# EAGLE design right (EAGLE 9.6.2)
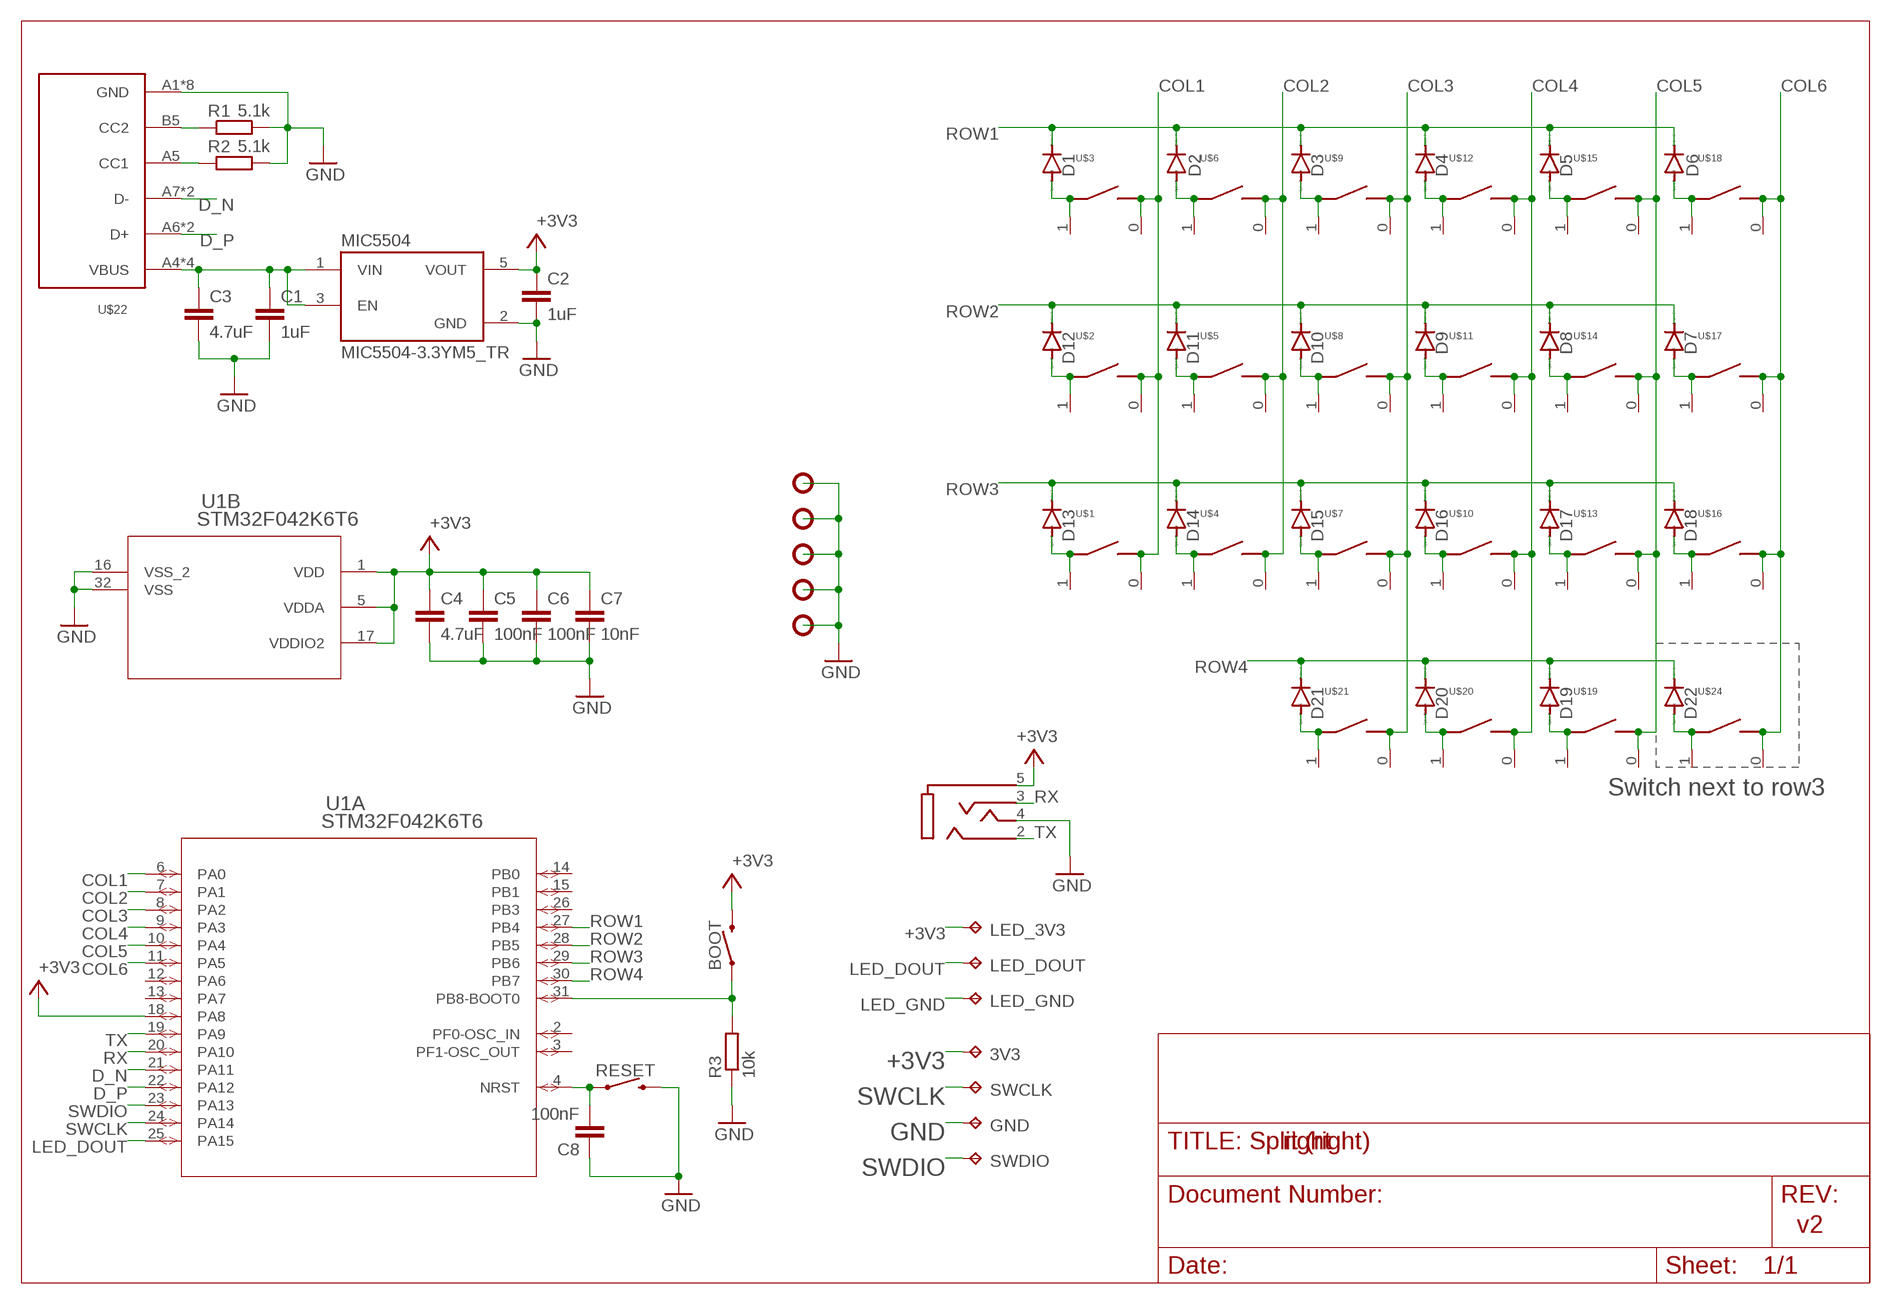
[diagram p0: schematic, sheet 1]

## Parts
3V3  TPTP20R  [TP20R]
BOOT  MOMENTARY-SWITCH-SPST-SMD-6.2MM-TALL  [TACTILE_SWITCH_SMD_6.2MM]
C1  1uF  C-EUC0603  [C0603]
C2  1uF  C-EUC0603  [C0603]
C3  4.7uF  C-EUC0603  [C0603]
C4  4.7uF  C-EUC0603  [C0603]
C5  100nF  C-EUC0603  [C0603]
C6  100nF  C-EUC0603  [C0603]
C7  10nF  C-EUC0603  [C0603]
C8  100nF  C-EUC0603  [C0603]
D1  DIODE-MINIMELF  [MINIMELF]
D2  DIODE-MINIMELF  [MINIMELF]
D3  DIODE-MINIMELF  [MINIMELF]
D4  DIODE-MINIMELF  [MINIMELF]
D5  DIODE-MINIMELF  [MINIMELF]
D6  DIODE-MINIMELF  [MINIMELF]
D7  DIODE-MINIMELF  [MINIMELF]
D8  DIODE-MINIMELF  [MINIMELF]
D9  DIODE-MINIMELF  [MINIMELF]
D10  DIODE-MINIMELF  [MINIMELF]
D11  DIODE-MINIMELF  [MINIMELF]
D12  DIODE-MINIMELF  [MINIMELF]
D13  DIODE-MINIMELF  [MINIMELF]
D14  DIODE-MINIMELF  [MINIMELF]
D15  DIODE-MINIMELF  [MINIMELF]
D16  DIODE-MINIMELF  [MINIMELF]
D17  DIODE-MINIMELF  [MINIMELF]
D18  DIODE-MINIMELF  [MINIMELF]
D19  DIODE-MINIMELF  [MINIMELF]
D20  DIODE-MINIMELF  [MINIMELF]
D21  DIODE-MINIMELF  [MINIMELF]
D22  DIODE-MINIMELF  [MINIMELF]
GND  TPTP20R  [TP20R]
LED_3V3  TPTP20R  [TP20R]
LED_DOUT  TPTP20R  [TP20R]
LED_GND  TPTP20R  [TP20R]
MIC5504  MIC5504-3.3YM5_TR  [SOT95P280X145-5N]
R1  5.1k  R-EU_R0603  [R0603]
R2  5.1k  R-EU_R0603  [R0603]
R3  10k  R-EU_R0603  [R0603]
RESET  MOMENTARY-SWITCH-SPST-SMD-6.2MM-TALL  [TACTILE_SWITCH_SMD_6.2MM]
SWCLK  TPTP20R  [TP20R]
SWDIO  TPTP20R  [TP20R]
U1  STM32F042K6T6  [LQFP-32]
U$1  CHOC-CHOC-1U  [CHOC-1U]
U$2  CHOC-CHOC-1U  [CHOC-1U]
U$3  CHOC-CHOC-1U  [CHOC-1U]
U$4  CHOC-CHOC-1U  [CHOC-1U]
U$5  CHOC-CHOC-1U  [CHOC-1U]
U$6  CHOC-CHOC-1U  [CHOC-1U]
U$7  CHOC-CHOC-1U  [CHOC-1U]
U$8  CHOC-CHOC-1U  [CHOC-1U]
U$9  CHOC-CHOC-1U  [CHOC-1U]
U$10  CHOC-CHOC-1U  [CHOC-1U]
U$11  CHOC-CHOC-1U  [CHOC-1U]
U$12  CHOC-CHOC-1U  [CHOC-1U]
U$13  CHOC-CHOC-1U  [CHOC-1U]
U$14  CHOC-CHOC-1U  [CHOC-1U]
U$15  CHOC-CHOC-1U  [CHOC-1U]
U$16  CHOC-CHOC-1U  [CHOC-1U]
U$17  CHOC-CHOC-1U  [CHOC-1U]
U$18  CHOC-CHOC-1U  [CHOC-1U]
U$19  CHOC-CHOC-1U  [CHOC-1U]
U$20  CHOC-CHOC-1U  [CHOC-1U]
U$21  CHOC-CHOC-1U  [CHOC-1U]
U$22  217B-AG01  [217B-AG01]
U$23  PJ320A  [PJ320A]
U$24  CHOC-CHOC-1U  [CHOC-1U]
U$25  SOCKET  [CHOC-SOCKET]
U$26  SOCKET  [CHOC-SOCKET]
U$27  SOCKET  [CHOC-SOCKET]
U$28  SOCKET  [CHOC-SOCKET]
U$29  SOCKET  [CHOC-SOCKET]
U$30  SOCKET  [CHOC-SOCKET]
U$31  SOCKET  [CHOC-SOCKET]
U$32  SOCKET  [CHOC-SOCKET]
U$33  SOCKET  [CHOC-SOCKET]
U$34  SOCKET  [CHOC-SOCKET]
U$35  SOCKET  [CHOC-SOCKET]
U$36  SOCKET  [CHOC-SOCKET]
U$37  SOCKET  [CHOC-SOCKET]
U$38  SOCKET  [CHOC-SOCKET]
U$39  SOCKET  [CHOC-SOCKET]
U$40  SOCKET  [CHOC-SOCKET]
U$41  SOCKET  [CHOC-SOCKET]
U$42  SOCKET  [CHOC-SOCKET]
U$43  SOCKET  [CHOC-SOCKET]
U$44  SOCKET  [CHOC-SOCKET]
U$45  SOCKET  [CHOC-SOCKET]
U$46  SOCKET  [CHOC-SOCKET]
U$47  MOUNTING-PADHOLE-M2-OFFSET  [HOLE-M2-OFFSET]
U$48  MOUNTING-PADHOLE-M2-OFFSET  [HOLE-M2-OFFSET]
U$49  MOUNTING-PADHOLE-M2-OFFSET  [HOLE-M2-OFFSET]
U$50  MOUNTING-PADHOLE-M2-OFFSET  [HOLE-M2-OFFSET]
U$51  MOUNTING-PADHOLE-M2-OFFSET  [HOLE-M2-OFFSET]

## Nets
+3V3: 3V3.TP BOOT.B2 C2.1 C4.1 C5.1 C6.1 C7.1 LED_3V3.TP MIC5504.5(VOUT) U1.1(B:VDD) U1.5(B:VDDA) U1.17(B:VDDIO2) U1.18(A:PA8) U$23.5
COL1: U1.6(A:PA0) U$1.1 U$2.1 U$3.1 U$25.0 U$26.0 U$30.0
COL2: U1.7(A:PA1) U$4.1 U$5.1 U$6.1 U$27.0 U$31.0 U$46.0
COL3: U1.8(A:PA2) U$7.1 U$8.1 U$9.1 U$21.1 U$28.0 U$29.0 U$32.0 U$34.0
COL4: U1.9(A:PA3) U$10.1 U$11.1 U$12.1 U$20.1 U$33.0 U$35.0 U$41.0 U$45.0
COL5: U1.10(A:PA4) U$13.1 U$14.1 U$15.1 U$19.1 U$36.0 U$39.0 U$40.0 U$44.0
COL6: U1.11(A:PA5) U$16.1 U$17.1 U$18.1 U$24.1 U$37.0 U$38.0 U$42.0 U$43.0
D_N: U1.21(A:PA11) U$22.A7(D-) U$22.B7(D-)
D_P: U1.22(A:PA12) U$22.A6(D+) U$22.B6(D+)
GND: C1.2 C2.2 C3.2 C4.2 C5.2 C6.2 C7.2 C8.1 GND.TP MIC5504.2(GND) R1.2 R2.2 R3.1 RESET.B2 U1.16(B:VSS_2) U1.32(B:VSS) U$22.A1(GND) U$22.A12(GND) U$22.B1(GND) U$22.B12(GND) U$22.SHELL1(GND) U$22.SHELL2(GND) U$22.SHELL3(GND) U$22.SHELL(GND) U$23.4 U$47.P$1(P) U$48.P$1(P) U$49.P$1(P) U$50.P$1(P) U$51.P$1(P)
LED_DOUT: LED_DOUT.TP U1.25(A:PA15)
LED_GND: LED_GND.TP
N$1: R2.1 U$22.A5(CC1)
N$2: R1.1 U$22.B5(CC2)
N$3: C1.1 C3.1 MIC5504.1(VIN) MIC5504.3(EN) U$22.A4(VBUS) U$22.A9(VBUS) U$22.B4(VBUS) U$22.B9(VBUS)
N$4: D1.A U$3.0 U$26.1
N$5: D2.A U$6.0 U$27.1
N$7: D12.A U$2.0 U$25.1
N$8: D11.A U$5.0 U$46.1
N$9: BOOT.A2 R3.2 U1.31(A:PB8-BOOT0)
N$10: C8.2 RESET.A2 U1.4(A:NRST)
N$11: D18.A U$16.0 U$38.1
N$12: D10.A U$8.0 U$29.1
N$13: D9.A U$11.0 U$41.1
N$14: D8.A U$14.0 U$40.1
N$15: D7.A U$17.0 U$42.1
N$16: D22.A U$24.0 U$37.1
N$17: D17.A U$13.0 U$39.1
N$18: D13.A U$1.0 U$30.1
N$19: D14.A U$4.0 U$31.1
N$20: D15.A U$7.0 U$32.1
N$21: D16.A U$10.0 U$33.1
N$22: D20.A U$20.0 U$35.1
N$23: D3.A U$9.0 U$28.1
N$24: D4.A U$12.0 U$45.1
N$25: D5.A U$15.0 U$44.1
N$26: D6.A U$18.0 U$43.1
N$27: D21.A U$21.0 U$34.1
N$28: D19.A U$19.0 U$36.1
ROW1: D1.C D2.C D3.C D4.C D5.C D6.C U1.27(A:PB4)
ROW2: D7.C D8.C D9.C D10.C D11.C D12.C U1.28(A:PB5)
ROW3: D13.C D14.C D15.C D16.C D17.C D18.C U1.29(A:PB6)
ROW4: D19.C D20.C D21.C D22.C U1.30(A:PB7)
RX: U1.20(A:PA10) U$23.3
SWCLK: SWCLK.TP U1.24(A:PA14)
SWDIO: SWDIO.TP U1.23(A:PA13)
TX: U1.19(A:PA9) U$23.2
Unconnected: U1.2(A:PF0-OSC_IN) U1.3(A:PF1-OSC_OUT) U1.12(A:PA6) U1.13(A:PA7) U1.14(A:PB0) U1.15(A:PB1) U1.26(A:PB3)

## Notes on the sheet
- Switch next to row3
- Split (right)
- v2

## Library data of the parts
3V3 GND LED_3V3 LED_DOUT LED_GND SWCLK SWDIO = testpad:TP: Test pad
BOOT RESET = PTS645SH50SMTR92LFS:MOMENTARY-SWITCH-SPST: PTS645SH50SMTR92LFS C&K SPST Pushbutton; PROD_ID: SWCH-11966; SF_SKU: COM-12992
C1-C8 = rcl:C-EU: CAPACITOR, European symbol; SPICEPREFIX: C
D1-D22 = diode:DIODE-: DIODE
MIC5504 = MIC5504-3.3YM5_TR:MIC5504-3.3YM5_TR: Linear Voltage Regulator IC 1 Output 300mA SOT-23-5; AVAILABILITY: Unavailable; DESCRIPTION: Linear Voltage Regulator IC 1 Output 300mA SOT-23-5; MF: Microchip; MP: MIC5504-3.3YM5 TR; PACKAGE: SOT-23 Microchip; PRICE: None
R1-R3 = rcl:R-EU_: RESISTOR, European symbol; SPICEPREFIX: R
U1 = STM32F042K6T6:STM32F042K6T6; BUILT_BY: EMA_UL_Team; COPYRIGHT: Copyright (C) 2018 Accelerated Designs. All rights reserved; MANUFACTURER_PART_NUMBER: STM32F042K6T6; SOURCELIBRARY: Updates_to_database_2020-10-19; VENDOR: STMicroelectronics
U$1-U$21 U$24 = choc:CHOC
U$22 = usbc:217B-AG01
U$23 = PJ320A:PJ320A
U$25-U$46 = choc:SOCKET
U$47-U$51 = platedhole:MOUNTING-PAD

## Board
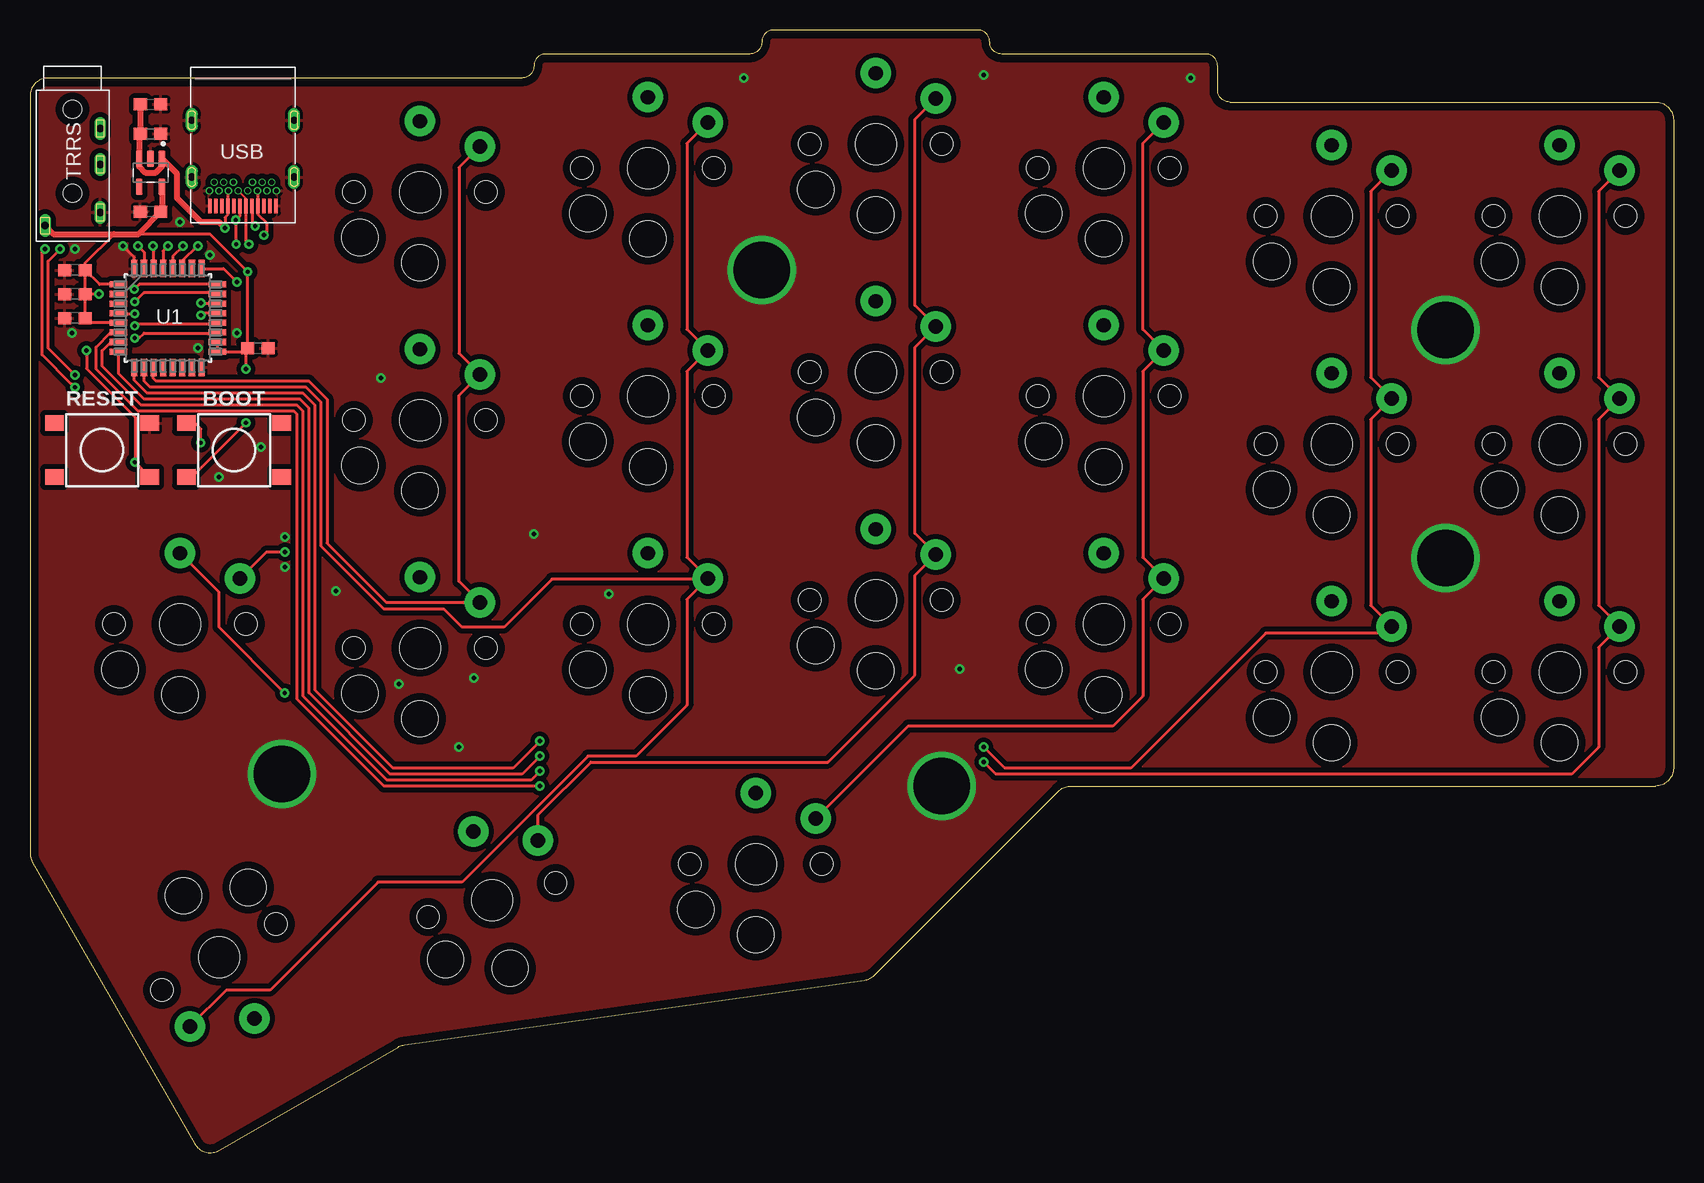
[diagram p1: board, top side]
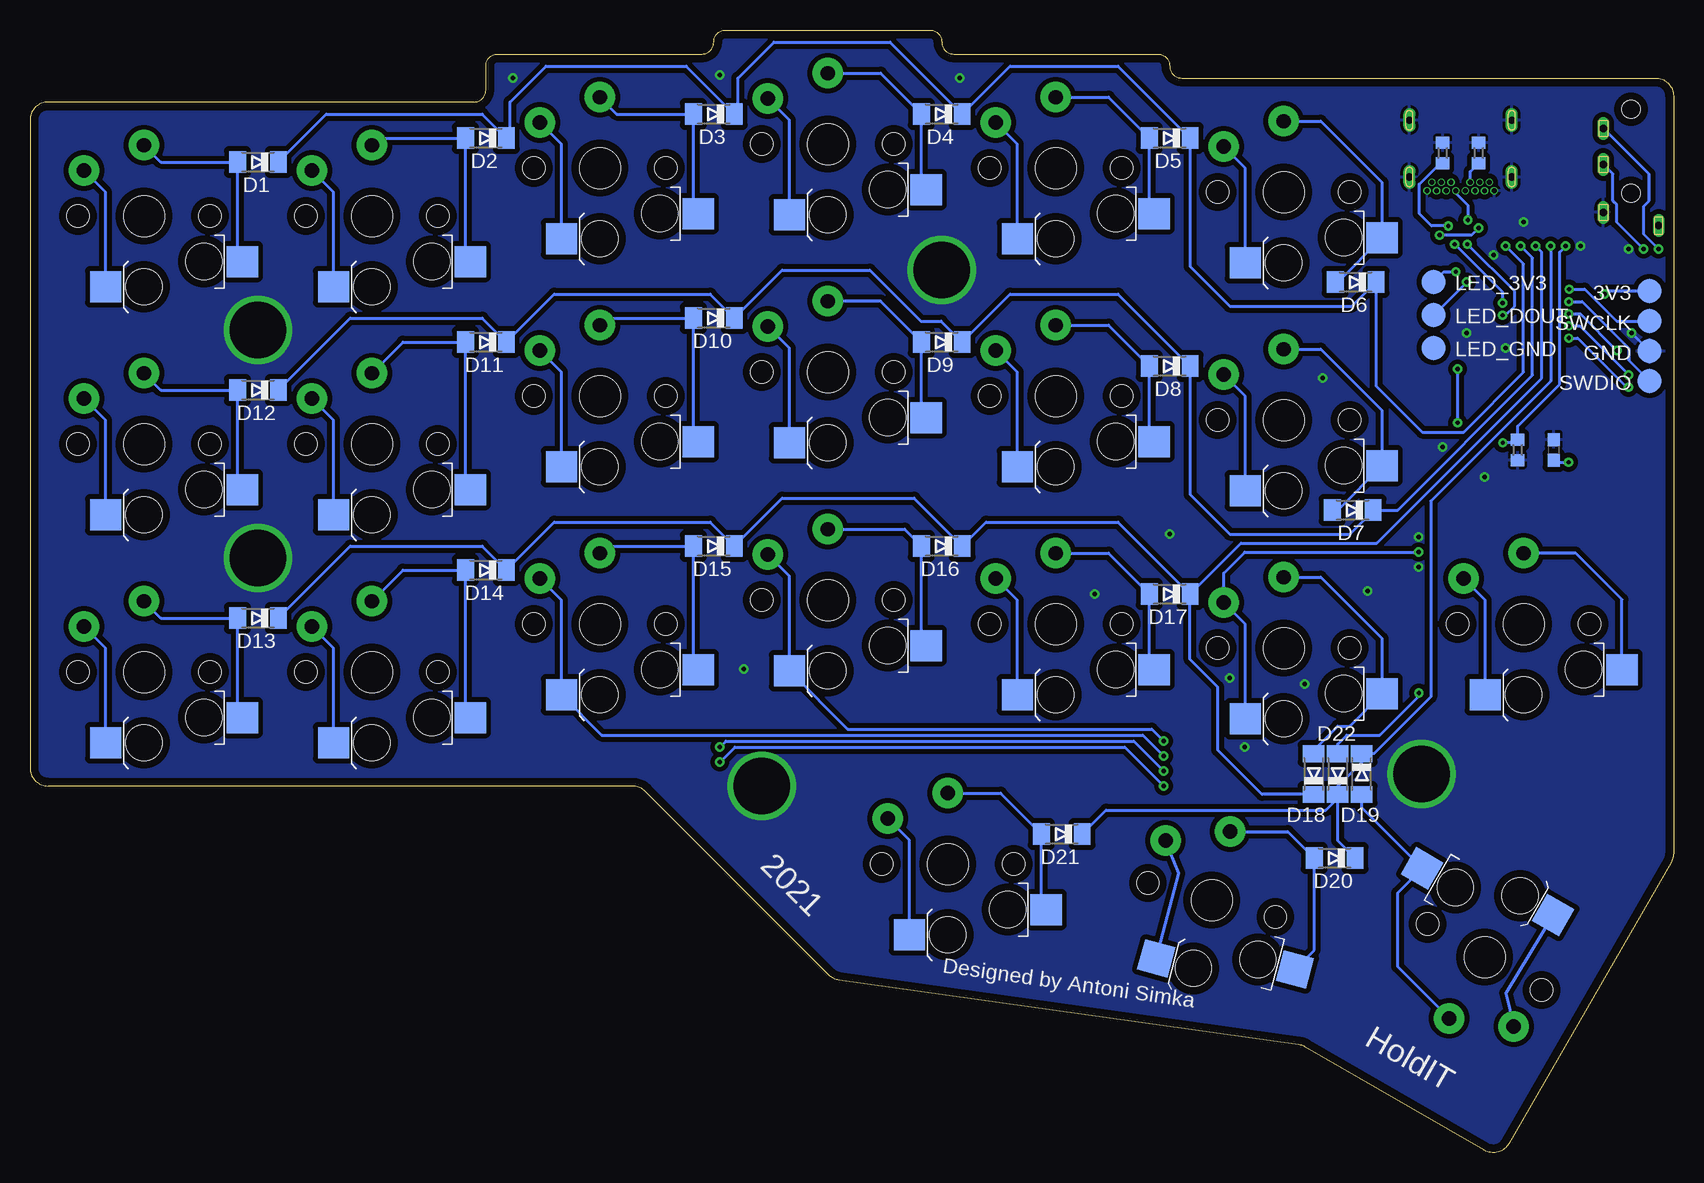
[diagram p2: board, bottom side, seen from below]

Size 137 x 93.56 mm. Coordinates in mm from the lower left corner, seen from the top.
Outline: 100,87.56 135.5,87.56 arc-90 137,86.06 137,32.06 arc-90 135.5,30.56 86.78,30.56 arc45 85.72,30.12 70.41,14.8 arc-37 69.55,14.38 31.22,8.99 arc22 30.68,8.8 15.78,0.2 arc-90 13.73,0.75 0.2,24.21 arc-30 0,24.96 0,88.06 arc-90 1.5,89.56 41,89.56 arc90 42,90.56 arc-90 43,91.56 60,91.56 arc90 61,92.56 arc-90 62,93.56 79,93.56 arc-90 80,92.56 arc90 81,91.56 98,91.56 arc-90 99,90.56 99,88.56 arc90 100,87.56
Copper layers (1*16): Top 0.035mm / dielectric 1.5mm / Bottom 0.035mm
Design rules "default *": minimum track width 6mil, minimum drill 10mil, track to track 8mil, track to pad 8mil, pad to pad 7mil, via to via 10mil, smd to smd 7mil, copper to edge 25mil, drill to drill 6mil, minimum pad ring 4mil, minimum via ring 8mil, stop-mask expansion 4mil, vias tented up to drill 0mil, thermal gap 10mil

### Footprints (pad centres in the part's own frame; a part is rotated, then mirrored left to right if it is on the bottom)
TP20R = smd 2 x 2: TP 0,0
TACTILE_SWITCH_SMD_6.2MM = smd 1.55 x 1.3: A1 -3.975,-2.25; A2 3.975,-2.25; B1 -3.975,2.25; B2 3.975,2.25
C0603 = smd 1.1 x 1: 1 -0.85,0; 2 0.85,0
MINIMELF = smd 1.4 x 1.8: A 1.7,0; C -1.7,0
SOT95P280X145-5N = smd 1.39 x 0.58: 1 -1.165,0.95; 2 -1.165,0; 3 -1.165,-0.95; 4 1.165,-0.95; 5 1.165,0.95
R0603 = smd 1 x 1.1: 1 -0.85,0; 2 0.85,0
LQFP-32 = smd 1.473 x 0.508: 1 -4.115,2.8; 2 -4.115,2; 3 -4.115,1.2; 4 -4.115,0.4; 5 -4.115,-0.4; 6 -4.115,-1.2; 7 -4.115,-2; 8 -4.115,-2.8; 17 4.115,-2.8; 18 4.115,-2; 19 4.115,-1.2; 20 4.115,-0.4; 21 4.115,0.4; 22 4.115,1.2; 23 4.115,2; 24 4.115,2.8 | smd 0.508 x 1.473: 9 -2.8,-4.115; 10 -2,-4.115; 11 -1.2,-4.115; 12 -0.4,-4.115; 13 0.4,-4.115; 14 1.2,-4.115; 15 2,-4.115; 16 2.8,-4.115; 25 2.8,4.115; 26 2,4.115; 27 1.2,4.115; 28 0.4,4.115; 29 -0.4,4.115; 30 -1.2,4.115; 31 -2,4.115; 32 -2.8,4.115
CHOC-1U = drill 1.2 pad 2.54: 0 0,5.9; 1 5,3.8 | hole 3.4: 0,0 | hole 1.85: -5.5,0; 5.5,0
217B-AG01 = smd 0.3 x 1.2: A1 2.75,0.6; A2 2.25,0.6; A3 1.75,0.6; A4 1.25,0.6; A5 0.75,0.6; A6 0.25,0.6; A7 -0.25,0.6; A8 -0.75,0.6; A9 -1.25,0.6; A10 -1.75,0.6; A11 -2.25,0.6; A12 -2.75,0.6 | drill 0.4 pad 0.55: B1 -2.8,1.855; B2 -2.4,2.555; B3 -1.6,2.555; B4 -1.2,1.855; B5 -0.8,2.555; B6 -0.4,1.855; B7 0.4,1.855; B8 0.8,2.555; B9 1.2,1.855; B10 1.6,2.555; B11 2.4,2.555; B12 2.8,1.855; MID -2,1.855; MID1 2,1.855 | drill 0.6 pad 1 long: SHELL -4.27,3; SHELL1 -4.27,7.73; SHELL2 4.27,7.73; SHELL3 4.27,3
PJ320A = drill 0.65 long: 2 -0.75,-3.2; 3 -0.75,-6.2; 4 -0.75,-10.2; 5 -5.35,-11.3 | hole 1.5: -3.05,-1.6; -3.05,-8.6
CHOC-SOCKET = smd 2.6 x 2.6: 0 -3.2,-5.9; 1 8.2,-3.8 | hole 3: 0,-5.9; 5,-3.8
HOLE-M2-OFFSET = drill 4.7: P$1 0,0

### Placement (x,y rotation side)
3V3  2,71.81 0 bottom
BOOT  17,58.56 180 top
C1  10.05,84.91 0 top
C2  10.05,78.41 180 top
C3  10.05,87.36 0 top
C4  3.75,71.56 180 top
C5  3.75,73.56 180 top
C6  19,67.06 0 top
C7  3.75,69.56 180 top
C8  10,58.56 270 bottom
D1  118,82.56 180 bottom
D2  99,84.56 180 bottom
D3  80,86.56 180 bottom
D4  61,86.56 180 bottom
D5  42,84.56 180 bottom
D6  26.5,72.56 180 bottom
D7  26.75,53.56 180 bottom
D8  42,65.56 180 bottom
D9  61,67.56 180 bottom
D10  80,69.56 180 bottom
D11  99,67.56 180 bottom
D12  118,63.56 180 bottom
D13  118,44.56 180 bottom
D14  99,48.56 180 bottom
D15  80,50.56 180 bottom
D16  61,50.56 180 bottom
D17  42,46.56 180 bottom
D18  30,31.56 90 bottom
D19  26,31.56 270 bottom
D20  28.25,24.56 180 bottom
D21  51,26.56 180 bottom
D22  28,31.56 90 bottom
GND  2,66.81 0 bottom
LED_3V3  20,72.56 0 bottom
LED_DOUT  20,69.81 0 bottom
LED_GND  20,67.06 0 bottom
MIC5504  10.05,81.66 270 top
R1  16.25,83.31 90 bottom
R2  19.25,83.31 90 bottom
R3  13,58.56 90 bottom
RESET  6,58.56 0 top
SWCLK  2,69.31 0 bottom
SWDIO  2,64.31 0 bottom
U1  11.5,69.56 0 top
U$1  127.5,40.06 0 top
U$2  127.5,59.06 0 top
U$3  127.5,78.06 0 top
U$4  108.5,40.06 0 top
U$5  108.5,59.06 0 top
U$6  108.5,78.06 0 top
U$7  89.5,44.06 0 top
U$8  89.5,63.06 0 top
U$9  89.5,82.06 0 top
U$10  70.5,46.06 0 top
U$11  70.5,65.06 0 top
U$12  70.5,84.06 0 top
U$13  51.5,44.06 0 top
U$14  51.5,63.06 0 top
U$15  51.5,82.06 0 top
U$16  32.5,42.06 0 top
U$17  32.5,61.06 0 top
U$18  32.5,80.06 0 top
U$19  15.75,16.31 210 top
U$20  38.5,21.06 15 top
U$21  60.5,24.06 0 top
U$22  17.75,78.31 0 top
U$23  6.6,88.56 0 top
U$24  12.5,44.06 0 top
U$25  127.5,59.06 0 bottom
U$26  127.5,78.06 0 bottom
U$27  108.5,78.06 0 bottom
U$28  89.5,82.06 0 bottom
U$29  89.5,63.06 0 bottom
U$30  127.5,40.06 0 bottom
U$31  108.5,40.06 0 bottom
U$32  89.5,44.06 0 bottom
U$33  70.5,46.06 0 bottom
U$34  60.5,24.06 0 bottom
U$35  38.5,21.06 345 bottom
U$36  15.75,16.31 150 bottom
U$37  12.5,44.06 0 bottom
U$38  32.5,42.06 0 bottom
U$39  51.5,44.06 0 bottom
U$40  51.5,63.06 0 bottom
U$41  70.5,65.06 0 bottom
U$42  32.5,61.06 0 bottom
U$43  32.5,80.06 0 bottom
U$44  51.5,82.06 0 bottom
U$45  70.5,84.06 0 bottom
U$46  108.5,59.06 0 bottom
U$47  21,31.56 0 top
U$48  76,30.56 0 top
U$49  118,49.56 0 top
U$50  118,68.56 0 top
U$51  61,73.56 0 top

### Tracks (layer width: path | path; a pad name or v marks a point on that pad's centre or on a via)
+3V3  (via drill 0.35)
  Top 0.254: U1.18 U1.17 17.85,66.76 C6.1 | v5.75,71.56 C4.1 | U1.1 5.8,72.36 C5.1 | U1.5 5,69.16 C7.1 C4.1 | C4.1 C5.1 | C5.1 4.6,74.16 7,76.56 | C6.1 v18.15,73.41 15,76.56 9.05,76.56 | BOOT.B2 13.49,56.31 v18,60.82 | v18,65.31 18,66.91 C6.1
  Top 0.508: MIC5504.5 11,78.51 C2.1 9.05,76.56 7,76.56 1.95,76.56 U$23.5
  Bottom 0.254: 3V3.TP 5.5,71.81 v5.75,71.56 | v18,60.82 v18,65.31 | LED_3V3.TP 19.15,73.41 v18.15,73.41
COL1  (via drill 0.35)
  Top 0.254: U$3.1 130.75,80.11 130.75,64.61 U$2.1 130.75,61.11 130.75,45.61 U$1.1 130.75,42.11 130.75,33.81 128.5,31.56 80.5,31.56 v79.5,32.56 | U1.6 6.73,68.36 5.5,67.13 5.5,65.31 9,61.81 22,61.81 22.25,61.56 22.25,37.81 29.5,30.56 v42.5,30.56
  Bottom 0.254: U$30.0 130.7,42.06 U$1.1 | U$25.0 130.7,61.06 U$2.1 | U$26.0 130.7,80.06 U$3.1 | v42.5,30.56 45.75,33.81 78.25,33.81 v79.5,32.56
COL2  (via drill 0.35)
  Top 0.254: U$6.1 111.75,80.11 111.75,64.61 U$5.1 111.75,61.11 111.75,45.61 U$4.1 112.95,43.31 103,43.31 91.75,32.06 81.25,32.06 v79.5,33.81 | U1.7 6.73,67.56 6,66.83 6,65.56 9.25,62.31 22.25,62.31 22.75,61.81 22.75,38.06 29.75,31.06 41.75,31.06 v42.5,31.81
  Bottom 0.254: U$31.0 111.7,42.06 U$4.1 | U$46.0 111.7,61.06 U$5.1 | U$27.0 111.7,80.06 U$6.1 | v42.5,31.81 45,34.31 79,34.31 v79.5,33.81
COL3  (via drill 0.35)
  Top 0.254: U$9.1 92.75,84.11 92.75,68.61 U$8.1 92.75,65.11 92.75,49.61 U$7.1 92.75,46.11 92.75,38.06 90.25,35.56 73.2,35.56 U$21.1 | U1.8 7.38,64.92 9.5,62.81 22.5,62.81 23.25,62.06 23.25,38.31 30,31.56 41,31.56 v42.5,33.06
  Bottom 0.254: U$7.1 92.7,46.06 U$32.0 89.35,34.81 44.25,34.81 v42.5,33.06 | U$29.0 92.7,65.06 U$8.1 | U$28.0 92.7,84.06 U$9.1 | U$34.0 63.7,26.06 U$21.1
COL4  (via drill 0.35)
  Top 0.254: U$12.1 73.75,86.11 73.75,70.61 U$11.1 73.75,67.11 73.75,51.61 U$10.1 73.75,48.11 73.75,39.81 66.5,32.56 46.75,32.56 42.35,28.15 U$20.1 | U1.9 8.7,64.36 9.75,63.31 22.75,63.31 23.75,62.31 23.75,38.56 30.25,32.06 40.25,32.06 v42.5,34.31
  Bottom 0.254: U$45.0 73.7,86.06 U$12.1 | U$41.0 73.7,67.06 U$11.1 | U$10.1 73.7,48.06 U$33.0 68.85,35.31 43.5,35.31 v42.5,34.31 | U$35.0 41.25,23.31 U$20.1
COL5
  Top 0.254: U$15.1 54.75,84.11 54.75,68.61 U$14.1 54.75,65.11 54.75,49.61 U$13.1 | U1.10 9.5,64.31 10,63.81 23,63.81 24.25,62.56 24.25,50.56 29.5,45.31 34.5,45.31 36,43.81 39.5,43.81 43.5,47.81 56.45,47.81 U$13.1 | U$13.1 54.75,46.11 54.75,37.31 50.5,33.06 46.5,33.06 36,22.56 29,22.56 20,13.56 16.36,13.56 U$19.1
  Bottom 0.254: U$40.0 54.7,65.06 U$14.1 | U$39.0 54.7,46.06 U$13.1 | U$44.0 54.7,84.06 U$15.1 | U$36.0 14,13.31 U$19.1
COL6  (via drill 0.35)
  Top 0.254: U$18.1 35.75,82.11 35.75,66.61 U$17.1 35.75,63.11 35.75,47.61 U$16.1 29.7,45.86 24.75,50.81 24.75,62.81 23.25,64.31 10.5,64.31 10.25,64.56 10.25,65.39 U1.11 | v21.25,50.06 19.7,50.06 U$24.1
  Bottom 0.254: U$38.0 35.7,44.06 U$16.1 37.5,48.31 35.75,50.06 v21.25,50.06 | U$42.0 35.7,63.06 U$17.1 | U$43.0 35.7,82.06 U$18.1 | U$37.0 15.7,46.06 U$24.1
D_N  (via drill 0.35)
  Top 0.254: U$22.A7 17.5,78.08 v17.15,77.73 17.18,77.7 v17.18,75.71 | U1.21 14.41,69.96 v14.25,69.8
  Bottom 0.254: U$22.B7 18.15,79.96 17.15,78.96 v17.15,77.73 | v14.25,69.8 14.01,69.8 13.25,70.56 13.25,71.78 v17.18,75.71
D_P  (via drill 0.35)
  Top 0.152: U$22.B6 18,79.51 U$22.A6
  Top 0.254: U1.22 14.3,70.76 v14.25,70.81 | v18.25,75.71 18,75.96 U$22.A6
  Bottom 0.254: v14.25,70.81 14.25,71.71 v18.25,75.71
GND  (via drill 0.35)
  Top 0.254: U1.32 8.7,74.61 v7.75,75.56
  Bottom 0.254: GND.TP v3.5,68.31
  other vias: 3.75,75.31 14,67.06 17.25,68.31 12.5,77.56 19.25,58.81 21.25,51.31 21.25,48.81 25.5,46.81 42,51.56 48.25,46.56 30.75,39.06 37,39.56 77.5,40.31 59.5,89.56 79.5,89.81 96.75,89.56 15.75,56.31 29.25,64.56 35.75,33.81 15,74.81
  pour Bottom (isolate 0.406): -2,94.56 -2,-0.44 arc90 0,-2.44 138,-2.44 arc90 139,-1.44 139,94.56 arc90 138,95.56 -1,95.56 arc90
  pour Top (isolate 0.406): -3,95.56 -3,-2.44 arc90 -2,-3.44 139,-3.44 arc90 140,-2.44 140,95.56 arc90 139,96.56 -2,96.56 arc90
LED_DOUT  (via drill 0.35)
  Top 0.254: U1.25 16.14,73.67 v17.25,72.56
  Bottom 0.254: LED_DOUT.TP v17.25,72.56
N$1  (via drill 0.35)
  Top 0.254: U$22.A5 18.5,77.48 v18.76,77.23
  Bottom 0.254: v18.76,77.23 20.17,77.23 21.19,78.25 21.19,80.72 19.45,82.46 R2.1
N$2
  Bottom 0.254: U$22.B5 16.95,81.76 R1.1
N$3  (via drill 0.35)
  Top 0.254: U$22.B4 16.5,80.11 U$22.A9 16.48,78.89 16.48,78.17 16.25,77.94 v16.25,77.06 | U$22.B9 19,80.11 U$22.A4 19.02,78.89 19.02,78.17 19.75,77.44 19.75,76.72 v19.5,76.47
  Top 0.508: C3.1 C1.1 9.1,84.81 MIC5504.3 9.1,82.18 9.61,81.67 10.49,81.67 11,82.18 MIC5504.1 12.25,81.57 12.25,79.56 14.25,77.56 15.75,77.56 v16.25,77.06
  Bottom 0.254: v16.25,77.06 16.84,76.47 v19.5,76.47
N$4
  Bottom 0.254: U$26.1 119.7,74.66 D1.A 126.1,82.56 U$3.0
N$5
  Bottom 0.254: U$27.1 100.7,74.66 D2.A 107.9,84.56 U$6.0
N$7
  Bottom 0.254: U$25.1 119.7,55.66 D12.A 126.1,63.56 U$2.0
N$8
  Bottom 0.254: U$5.0 105.9,67.56 D11.A 100.7,55.66 U$46.1
N$9  (via drill 0.35)
  Top 0.254: v9,75.56 9.5,75.06 U1.31 | v14.24,59.16 14.24,60.32 13.75,60.81 BOOT.A2
  Bottom 0.254: v9,75.56 9.5,75.06 9.5,64.06 13,60.56 R3.2 13.25,59.16 v14.24,59.16
N$10  (via drill 0.35)
  Top 0.254: U1.4 7.44,69.91 v8.74,69.91 | RESET.A2 v8.75,57.53 8.75,61.31 4.71,65.35 v4.71,66.85
  Bottom 0.254: v8.74,69.91 7.77,69.91 v4.71,66.85 | C8.2 9.83,57.53 v8.75,57.53
N$11
  Bottom 0.254: U$16.0 29.4,47.96 24.3,42.86 U$38.1 27,35.56 28,35.56 30,33.56 D18.A
N$12
  Bottom 0.254: U$29.1 81.7,59.66 D10.A 88.9,69.56 U$8.0
N$13
  Bottom 0.254: U$11.0 66.1,70.96 D9.A 62.7,61.66 U$41.1
N$14
  Bottom 0.254: U$40.1 43.7,59.66 D8.A 47.1,68.96 U$14.0
N$15
  Bottom 0.254: U$17.0 29.4,66.96 24.3,61.86 U$42.1 28,53.56 D7.A
N$16  (via drill 0.35)
  Top 0.254: v21.24,38.31 15.75,43.8 15.75,46.71 U$24.0
  Bottom 0.254: U$37.1 4.3,46.11 8.15,49.96 U$24.0 | D22.A 28,34.06 27.25,34.81 24.49,34.81 21.24,38.06 v21.24,38.31
N$17
  Bottom 0.254: U$39.1 43.7,40.66 D17.A 47.1,49.96 U$13.0
N$18
  Bottom 0.254: U$1.0 126.1,44.56 D13.A 119.7,36.66 U$30.1
N$19
  Bottom 0.254: U$4.0 105.9,48.56 D14.A 100.7,36.66 U$31.1
N$20
  Bottom 0.254: U$7.0 88.9,50.56 D15.A 81.7,40.66 U$32.1
N$21
  Bottom 0.254: U$10.0 64.1,51.96 D16.A 62.7,42.66 U$33.1
N$22
  Bottom 0.254: U$35.1 29.95,16.88 D20.A 32.15,26.76 U$20.0
N$23
  Bottom 0.254: U$28.1 81.7,78.66 D3.A 88.1,86.56 U$9.0
N$24
  Bottom 0.254: U$45.1 62.7,80.66 D4.A 66.1,89.96 U$12.0
N$25
  Bottom 0.254: U$44.1 43.7,78.66 D5.A 47.1,87.96 U$15.0
N$26
  Bottom 0.254: U$18.0 29.4,85.96 24.3,80.86 U$43.1 28,72.56 D6.A
N$27
  Bottom 0.254: U$34.1 52.7,20.66 D21.A 56.1,29.96 U$21.0
N$28
  Bottom 0.254: U$19.0 23,15.5 23,21.65 U$36.1 26,28.75 D19.A
ROW1  (via drill 0.35)
  Top 0.254: U1.27 12.7,74.33 13.93,75.56 v14,75.56
  Bottom 0.254: v14,75.56 12.52,74.07 12.52,65.04 17.5,60.06 20.95,60.06 24.8,63.91 D6.C 26.8,70.56 37,70.56 40.3,73.86 D5.C 46.3,90.56 55.3,90.56 D4.C 65.3,92.56 75,92.56 78,89.56 78,86.86 D3.C 82.3,90.56 94,90.56 97,87.56 97,84.86 D2.C 99.3,86.56 112.3,86.56 D1.C
ROW2  (via drill 0.35)
  Top 0.254: v12.75,75.56 11.9,74.71 U1.28
  Bottom 0.254: v12.75,75.56 11.76,74.57 11.76,64.8 23,53.56 25,53.56 | D12.C 110.3,69.56 99.3,69.56 D11.C 93.3,71.56 80.3,71.56 D10.C 74.3,73.56 67,73.56 62.75,69.31 61.05,69.31 D9.C 55.3,71.56 46.3,71.56 D8.C 40.3,54.86 37,51.56 27,51.56 25,53.56 | D7.C 25,53.56
ROW3  (via drill 0.35)
  Top 0.254: v11.5,75.56 11.1,75.16 U1.29
  Bottom 0.254: v11.5,75.56 11,75.06 11,64.56 24.75,50.81 36.05,50.81 D17.C | D13.C 110.3,50.56 99.3,50.56 D14.C 93.3,52.56 80.3,52.56 D15.C 74.3,54.56 63.3,54.56 D16.C 57.3,52.56 46.3,52.56 D17.C | D18.C 34.3,29.86 38,33.56 38,38.81 40.3,41.11 D17.C
ROW4  (via drill 0.35)
  Top 0.254: v10.25,75.56 10.25,73.72 U1.30
  Bottom 0.254: v10.25,75.56 10.25,64.31 20.25,54.31 20.25,37.97 24.97,33.26 D19.C 26,32.56 28,30.56 D22.C 28,29.56 | D20.C 28,26.01 28,29.56 | D21.C 47.3,28.56 29,28.56 28,29.56
RX  (via drill 0.35)
  Top 0.254: U1.20 15.5,69.04 8.88,69.04 v8.74,68.9 | v2.5,75.31 1.5,74.31 1.5,67.06 v3.75,64.81
  Bottom 0.254: v8.74,68.9 7.83,68.9 v3.75,64.82 v3.75,64.81 | v2.5,75.31 4.75,77.56 4.75,79.02 5.06,79.33 5.06,81.57 U$23.3
SWCLK  (via drill 0.35)
  Top 0.254: U1.24 9.11,72.36 v8.7,71.95
  Bottom 0.254: v8.7,71.95 7.4,71.95 4.75,69.31 SWCLK.TP
SWDIO  (via drill 0.35)
  Top 0.254: U1.23 15.52,71.66 9.48,71.66 v8.74,70.92
  Bottom 0.254: v8.74,70.92 7.61,70.92 3.75,67.06 3.75,66.06 SWDIO.TP
TX  (via drill 0.35)
  Top 0.254: U1.19 15.56,68.31 9.5,68.31 9.08,67.89 v8.74,67.89 | v1.25,75.31 1,75.06 1,66.48 3.44,64.05 3.5,64.05 v3.75,63.8
  Bottom 0.254: v8.74,67.89 7.99,67.89 3.9,63.8 v3.75,63.8 | v1.25,75.31 2.5,76.56 2.5,78.87 2.04,79.33 2.04,81.54 U$23.2

### Text on the board
bPlace: 2021 | Designed by Antoni Simka | HoldIT
tNames: USB | TRRS